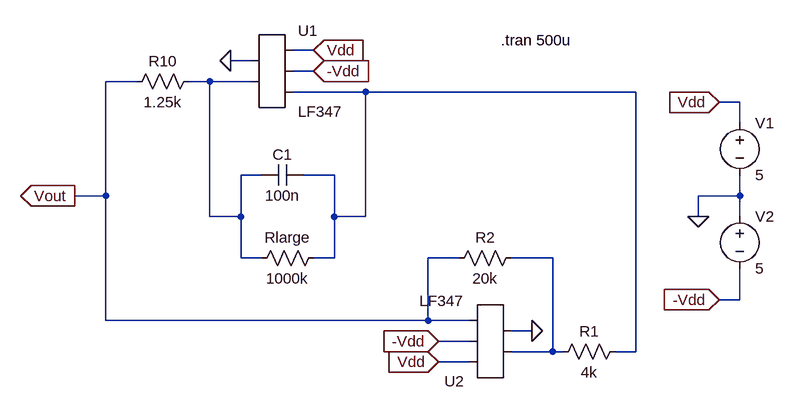
[diagram p0: schematic Q1.asc]
Q1.asc, the LTspice schematic file:
Version 4
SHEET 1 948 700
WIRE 0 112 -32 112
WIRE -96 128 -128 128
WIRE 0 144 -32 144
WIRE -272 160 -320 160
WIRE -160 160 -192 160
WIRE -96 160 -160 160
WIRE 80 176 -32 176
WIRE 496 176 80 176
WIRE 656 192 624 192
WIRE 656 224 656 192
WIRE -80 304 -112 304
WIRE 32 304 -16 304
WIRE -320 336 -320 160
WIRE -320 336 -368 336
WIRE 656 336 656 304
WIRE 656 336 592 336
WIRE -160 368 -160 160
WIRE -112 368 -112 304
WIRE -112 368 -160 368
WIRE 32 368 32 304
WIRE 80 368 80 176
WIRE 80 368 32 368
WIRE 592 368 592 336
WIRE 656 368 656 336
WIRE -112 432 -112 368
WIRE -80 432 -112 432
WIRE 32 432 32 368
WIRE 32 432 0 432
WIRE 224 432 176 432
WIRE 368 432 304 432
WIRE 656 496 656 448
WIRE 656 496 624 496
WIRE -320 528 -320 336
WIRE 176 528 176 432
WIRE 176 528 -320 528
WIRE 240 528 176 528
WIRE 336 544 304 544
WIRE 240 560 192 560
WIRE 368 576 368 432
WIRE 368 576 304 576
WIRE 384 576 368 576
WIRE 496 576 496 176
WIRE 496 576 464 576
WIRE 240 592 192 592
FLAG 624 496 -Vdd
IOPIN 624 496 In
FLAG 624 192 Vdd
IOPIN 624 192 In
FLAG 592 368 0
FLAG 0 112 Vdd
IOPIN 0 112 In
FLAG 0 144 -Vdd
IOPIN 0 144 In
FLAG 192 592 Vdd
IOPIN 192 592 In
FLAG 192 560 -Vdd
IOPIN 192 560 In
FLAG -128 128 0
FLAG 336 544 0
FLAG -368 336 Vout
IOPIN -368 336 Out
SYMBOL AutoGenerated/LF347 -64 144 R0
SYMATTR InstName U1
SYMBOL AutoGenerated/LF347 272 560 R180
SYMATTR InstName U2
SYMBOL voltage 656 208 R0
SYMATTR InstName V1
SYMATTR Value 5
SYMBOL voltage 656 352 R0
SYMATTR InstName V2
SYMATTR Value 5
SYMBOL res -176 144 R90
WINDOW 0 0 56 VBottom 2
WINDOW 3 32 56 VTop 2
SYMATTR InstName R10
SYMATTR Value 1.25k
SYMBOL res 16 416 R90
WINDOW 0 0 56 VBottom 2
WINDOW 3 32 56 VTop 2
SYMATTR InstName Rlarge
SYMATTR Value 1000k
SYMBOL res 480 560 R90
WINDOW 0 0 56 VBottom 2
WINDOW 3 32 56 VTop 2
SYMATTR InstName R1
SYMATTR Value 4k
SYMBOL res 320 416 R90
WINDOW 0 0 56 VBottom 2
WINDOW 3 32 56 VTop 2
SYMATTR InstName R2
SYMATTR Value 20k
SYMBOL cap -16 288 R90
WINDOW 0 0 32 VBottom 2
WINDOW 3 32 32 VTop 2
SYMATTR InstName C1
SYMATTR Value 100n
TEXT 288 96 Left 2 !.tran 500u

The netlist it stands for:
* Q1.asc
* U1: LF347 (symbol AutoGenerated/LF347 not available, pins judged from their places): pin1=0 pin2=N001 pin3=Vdd pin4=-Vdd pin5=N002
* U2: LF347 (symbol AutoGenerated/LF347 not available, pins judged from their places): pin1=N003 pin2=0 pin3=Vdd pin4=-Vdd pin5=Vout
V1 Vdd 0 5
V2 0 -Vdd 5
R10 N001 Vout 1.25k
Rlarge N002 N001 1000k
R1 N002 N003 4k
R2 N003 Vout 20k
C1 N002 N001 100n
.tran 500u
.backanno
.end